# Altium schematic sheet Gate_Drivers.SchDoc
size Legal
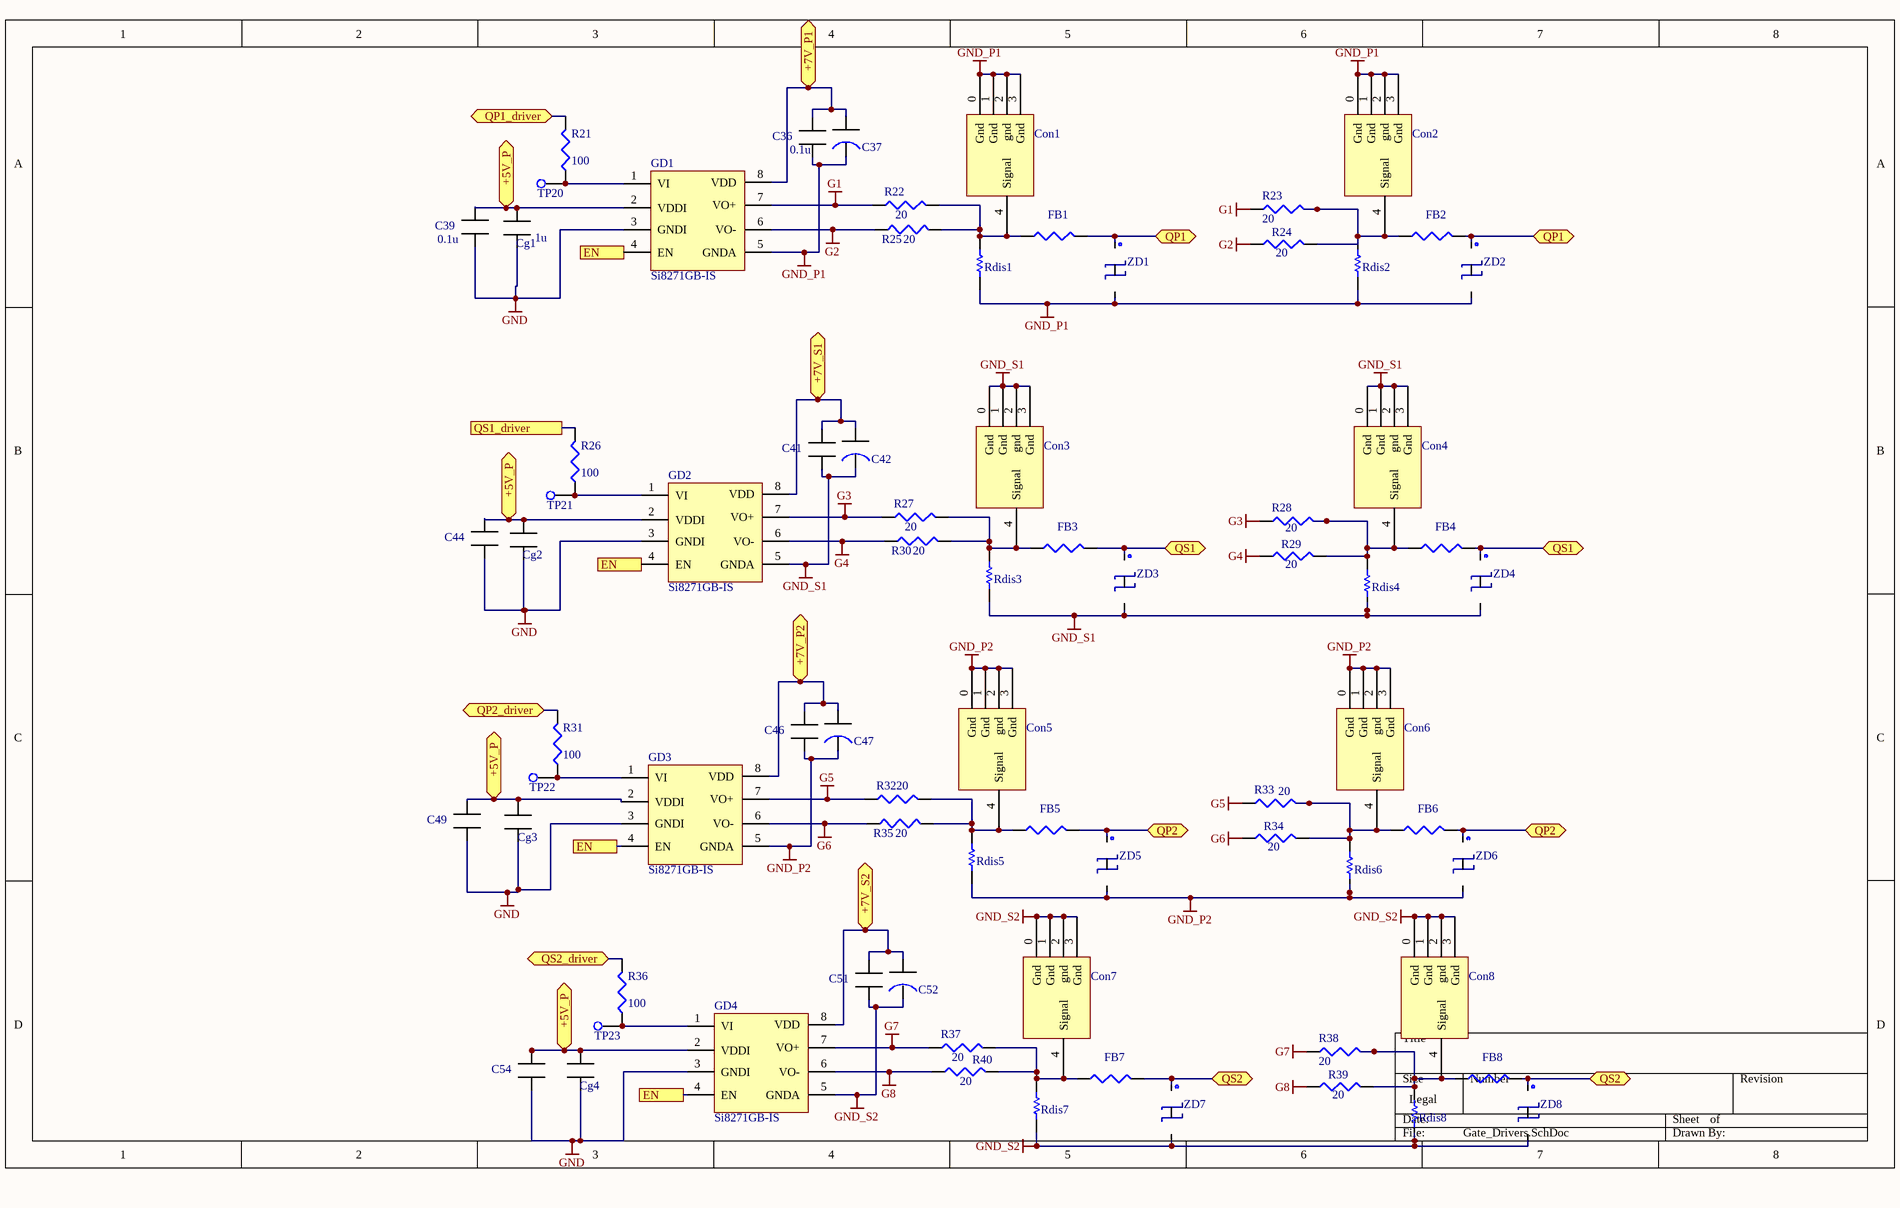
[diagram p0: Gate_Drivers.SchDoc]

## Parts
C36  100nF  [Cap_SMD]  (value not drawn)
C37  22uF  [Cap_tantalum]  (value not drawn)
C39  100nF  [Cap_SMD]  (value not drawn)
C41  100nF  [Cap_SMD]  (value not drawn)
C42  22uF  [Cap_tantalum]  (value not drawn)
C44  100nF  [Cap_SMD]  (value not drawn)
C46  100nF  [Cap_SMD]  (value not drawn)
C47  22uF  [Cap_tantalum]  (value not drawn)
C49  100nF  [Cap_SMD]  (value not drawn)
C51  100nF  [Cap_SMD]  (value not drawn)
C52  22uF  [Cap_tantalum]  (value not drawn)
C54  100nF  [Cap_SMD]  (value not drawn)
Cg1  100nF  [Cap_SMD]  (value not drawn)
Cg2  100nF  [Cap_SMD]  (value not drawn)
Cg3  100nF  [Cap_SMD]  (value not drawn)
Cg4  100nF  [Cap_SMD]  (value not drawn)
Con1  Component_1  [PCBComponent_1]  (value not drawn)
Con2  Component_1  [PCBComponent_1]  (value not drawn)
Con3  Component_1  [PCBComponent_1]  (value not drawn)
Con4  Component_1  [PCBComponent_1]  (value not drawn)
Con5  Component_1  [PCBComponent_1]  (value not drawn)
Con6  Component_1  [PCBComponent_1]  (value not drawn)
Con7  Component_1  [PCBComponent_1]  (value not drawn)
Con8  Component_1  [PCBComponent_1]  (value not drawn)
FB1  Res3  [J1-0603]  (value not drawn)
FB2  Res3  [J1-0603]  (value not drawn)
FB3  Res3  [J1-0603]  (value not drawn)
FB4  Res3  [J1-0603]  (value not drawn)
FB5  Res3  [J1-0603]  (value not drawn)
FB6  Res3  [J1-0603]  (value not drawn)
FB7  Res3  [J1-0603]  (value not drawn)
FB8  Res3  [J1-0603]  (value not drawn)
GD1  Si8271GB-IS  [Si8271]
GD2  Si8271GB-IS  [Si8271]
GD3  Si8271GB-IS  [Si8271]
GD4  Si8271GB-IS  [Si8271]
R21  value 100  [J1-0603]  (hidden comment: Res3)
R22  value 20  [J1-0603]  (hidden comment: Res3)
R23  value 20  [J1-0603]  (hidden comment: Res3)
R24  20  [J1-0603]
R25  value 20  [J1-0603]  (hidden comment: Res3)
R26  value 100  [J1-0603]  (hidden comment: Res3)
R27  value 20  [J1-0603]  (hidden comment: Res3)
R28  value 20  [J1-0603]  (hidden comment: Res3)
R29  20  [J1-0603]
R30  value 20  [J1-0603]  (hidden comment: Res3)
R31  value 100  [J1-0603]  (hidden comment: Res3)
R32  value 20  [J1-0603]  (hidden comment: Res3)
R33  value 20  [J1-0603]  (hidden comment: Res3)
R34  20  [J1-0603]
R35  value 20  [J1-0603]  (hidden comment: Res3)
R36  value 100  [J1-0603]  (hidden comment: Res3)
R37  value 20  [J1-0603]  (hidden comment: Res3)
R38  value 20  [J1-0603]  (hidden comment: Res3)
R39  20  [J1-0603]
R40  value 20  [J1-0603]  (hidden comment: Res3)
Rdis1  res_smd  [J1-0603]  (value not drawn)
Rdis2  res_smd  [J1-0603]  (value not drawn)
Rdis3  res_smd  [J1-0603]  (value not drawn)
Rdis4  res_smd  [J1-0603]  (value not drawn)
Rdis5  res_smd  [J1-0603]  (value not drawn)
Rdis6  res_smd  [J1-0603]  (value not drawn)
Rdis7  res_smd  [J1-0603]  (value not drawn)
Rdis8  res_smd  [J1-0603]  (value not drawn)
TP20  Test Point  [Test Point]  (value not drawn)
TP21  Test Point  [Test Point]  (value not drawn)
TP22  Test Point  [Test Point]  (value not drawn)
TP23  Test Point  [Test Point]  (value not drawn)
ZD1  8.2 v  [Zener Diode]  (value not drawn)
ZD2  8.2 v  [Zener Diode]  (value not drawn)
ZD3  8.2 v  [Zener Diode]  (value not drawn)
ZD4  8.2 v  [Zener Diode]  (value not drawn)
ZD5  8.2 v  [Zener Diode]  (value not drawn)
ZD6  8.2 v  [Zener Diode]  (value not drawn)
ZD7  8.2 v  [Zener Diode]  (value not drawn)
ZD8  8.2 v  [Zener Diode]  (value not drawn)

## Ports
+5V_P (bidir), +7V_P1 (bidir), +7V_P2 (bidir), +7V_S1 (bidir), +7V_S2 (bidir), EN, QP1 (bidir), QP1_driver (bidir), QP2 (bidir), QP2_driver (bidir), QS1 (bidir), QS1_driver, QS2 (bidir), QS2_driver (bidir)

## Nets
G1: GD1.7(VO+) R22.1 R23.1
G2: GD1.6(VO-) R24.1 R25.1
G3: GD2.7(VO+) R27.1 R28.1
G4: GD2.6(VO-) R29.1 R30.1
G5: GD3.7(VO+) R32.1 R33.1
G6: GD3.6(VO-) R34.1 R35.1
G7: GD4.7(VO+) R37.1 R38.1
G8: GD4.6(VO-) R39.1 R40.1
GND: C39.2 C44.2 C49.2 C54.2 Cg1.2 Cg2.2 Cg3.2 Cg4.2 GD1.3(GNDI) GD2.3(GNDI) GD3.3(GNDI) GD4.3(GNDI)
GND_P1: C36.2 C37.2 Con1.0(Gnd) Con1.1(Gnd) Con1.2(gnd) Con1.3(Gnd) Con2.0(Gnd) Con2.1(Gnd) Con2.2(gnd) Con2.3(Gnd) GD1.5(GNDA) Rdis1.2 Rdis2.2 ZD1.2 ZD2.2
GND_P2: C46.2 C47.2 Con5.0(Gnd) Con5.1(Gnd) Con5.2(gnd) Con5.3(Gnd) Con6.0(Gnd) Con6.1(Gnd) Con6.2(gnd) Con6.3(Gnd) GD3.5(GNDA) Rdis5.2 Rdis6.2 ZD5.2 ZD6.2
GND_S1: C41.2 C42.2 Con3.0(Gnd) Con3.1(Gnd) Con3.2(gnd) Con3.3(Gnd) Con4.0(Gnd) Con4.1(Gnd) Con4.2(gnd) Con4.3(Gnd) GD2.5(GNDA) Rdis3.2 Rdis4.2 ZD3.2 ZD4.2
GND_S2: C51.2 C52.2 Con7.0(Gnd) Con7.1(Gnd) Con7.2(gnd) Con7.3(Gnd) Con8.0(Gnd) Con8.1(Gnd) Con8.2(gnd) Con8.3(Gnd) GD4.5(GNDA) Rdis7.2 Rdis8.2 ZD7.2 ZD8.2
+5V_P: C39.1 C44.1 C49.1 C54.1 Cg1.1 Cg2.1 Cg3.1 Cg4.1 GD1.2(VDDI) GD2.2(VDDI) GD3.2(VDDI) GD4.2(VDDI) ; port +5V_P
+7V_P1: C36.1 C37.1 GD1.8(VDD) ; port +7V_P1
+7V_P2: C46.1 C47.1 GD3.8(VDD) ; port +7V_P2
+7V_S1: C41.1 C42.1 GD2.8(VDD) ; port +7V_S1
+7V_S2: C51.1 C52.1 GD4.8(VDD) ; port +7V_S2
EN: GD1.4(EN) GD2.4(EN) GD3.4(EN) GD4.4(EN) ; port EN
QP1: FB1.2 FB2.2 ZD1.1 ZD2.1 ; port QP1
QP1_driver: R21.2 ; port QP1_driver
QP2: FB5.2 FB6.2 ZD5.1 ZD6.1 ; port QP2
QP2_driver: R31.2 ; port QP2_driver
QS1: FB3.2 FB4.2 ZD3.1 ZD4.1 ; port QS1
QS1_driver: R26.2 ; port QS1_driver
QS2: FB7.2 FB8.2 ZD7.1 ZD8.1 ; port QS2
QS2_driver: R36.2 ; port QS2_driver
NetCon1_4: Con1.4(Signal) FB1.1 R22.2 R25.2 Rdis1.1
NetCon2_4: Con2.4(Signal) FB2.1 R23.2 R24.2 Rdis2.1
NetCon3_4: Con3.4(Signal) FB3.1 R27.2 R30.2 Rdis3.1
NetCon4_4: Con4.4(Signal) FB4.1 R28.2 R29.2 Rdis4.1
NetCon5_4: Con5.4(Signal) FB5.1 R32.2 R35.2 Rdis5.1
NetCon6_4: Con6.4(Signal) FB6.1 R33.2 R34.2 Rdis6.1
NetCon7_4: Con7.4(Signal) FB7.1 R37.2 R40.2 Rdis7.1
NetCon8_4: Con8.4(Signal) FB8.1 R38.2 R39.2 Rdis8.1
NetGD1_1: GD1.1(VI) R21.1 TP20.1(TP?)
NetGD2_1: GD2.1(VI) R26.1 TP21.1(TP?)
NetGD3_1: GD3.1(VI) R31.1 TP22.1(TP?)
NetGD4_1: GD4.1(VI) R36.1 TP23.1(TP?)

Not connected (* = marked no-connect by the designer): ZD1 3; ZD2 3; ZD3 3; ZD4 3; ZD5 3; ZD6 3; ZD7 3; ZD8 3

## Notes on the sheet
- (in symbol Cap_SMD) 0.1u; 1u

## Library data of the parts
C36 C39 C41 C44 C46 C49 C51 C54 Cg1-Cg4 = Cap_SMD
C37 C42 C47 C52 = Cap_tantalum
FB1-FB8 R24 R29 R34 R39 = Res3: Resistor; Value: 1K; Published: 8-Jun-2000; LatestRevisionDate: 29-May-2009; LatestRevisionNote: IPC-7351 Footprint Added.; PackageReference: J1-0603; Publisher: Altium Limited; PackageDescription: Chip Resistor
R21-R23 R25-R28 R30-R33 R35-R38 R40 = Res3: Resistor; Published: 8-Jun-2000; LatestRevisionDate: 29-May-2009; LatestRevisionNote: IPC-7351 Footprint Added.; PackageReference: J1-0603; Publisher: Altium Limited; PackageDescription: Chip Resistor
Rdis1-Rdis8 = res_smd: smd_res
ZD1-ZD8 = Zener_diode: DZ23C8V2-7-F